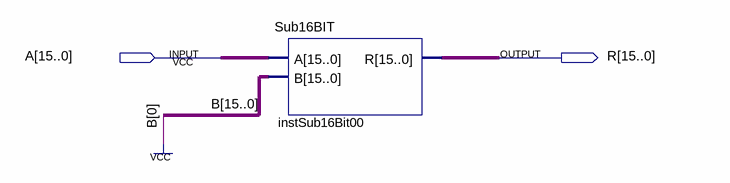
[diagram p0: schematic sheet]
// Quartus schematic DEC16BIT.bdf as structural Verilog: 1 symbols, 2 pins
module DEC16BIT (
  input  [15:0] A,
  output [15:0] R
);

  wire [15:1] B;

  Sub16BIT instSub16Bit00 (.A(A), .B({B, 1'b1}), .R(R));
endmodule
